# Altium schematic sheet 5DPD8_v1.0_OS_Sheet4.SchDoc: 5DPD8 Controller
size A4; Date: 10th Mar 14; CheckedBy: J. Wong/C. Lai; CompanyName: Makible Ltd.; DrawnBy: Martyn Kay; Engineer: Martyn Kay; Revision: 1.0; SheetNumber: 4; SheetTotal: 4; Website: 5DPrint.com; DesignFileLink: D8 Design Files; BasedOn: Printrboard Rev. B; OSHWLicense: CC BY-SA 4.0
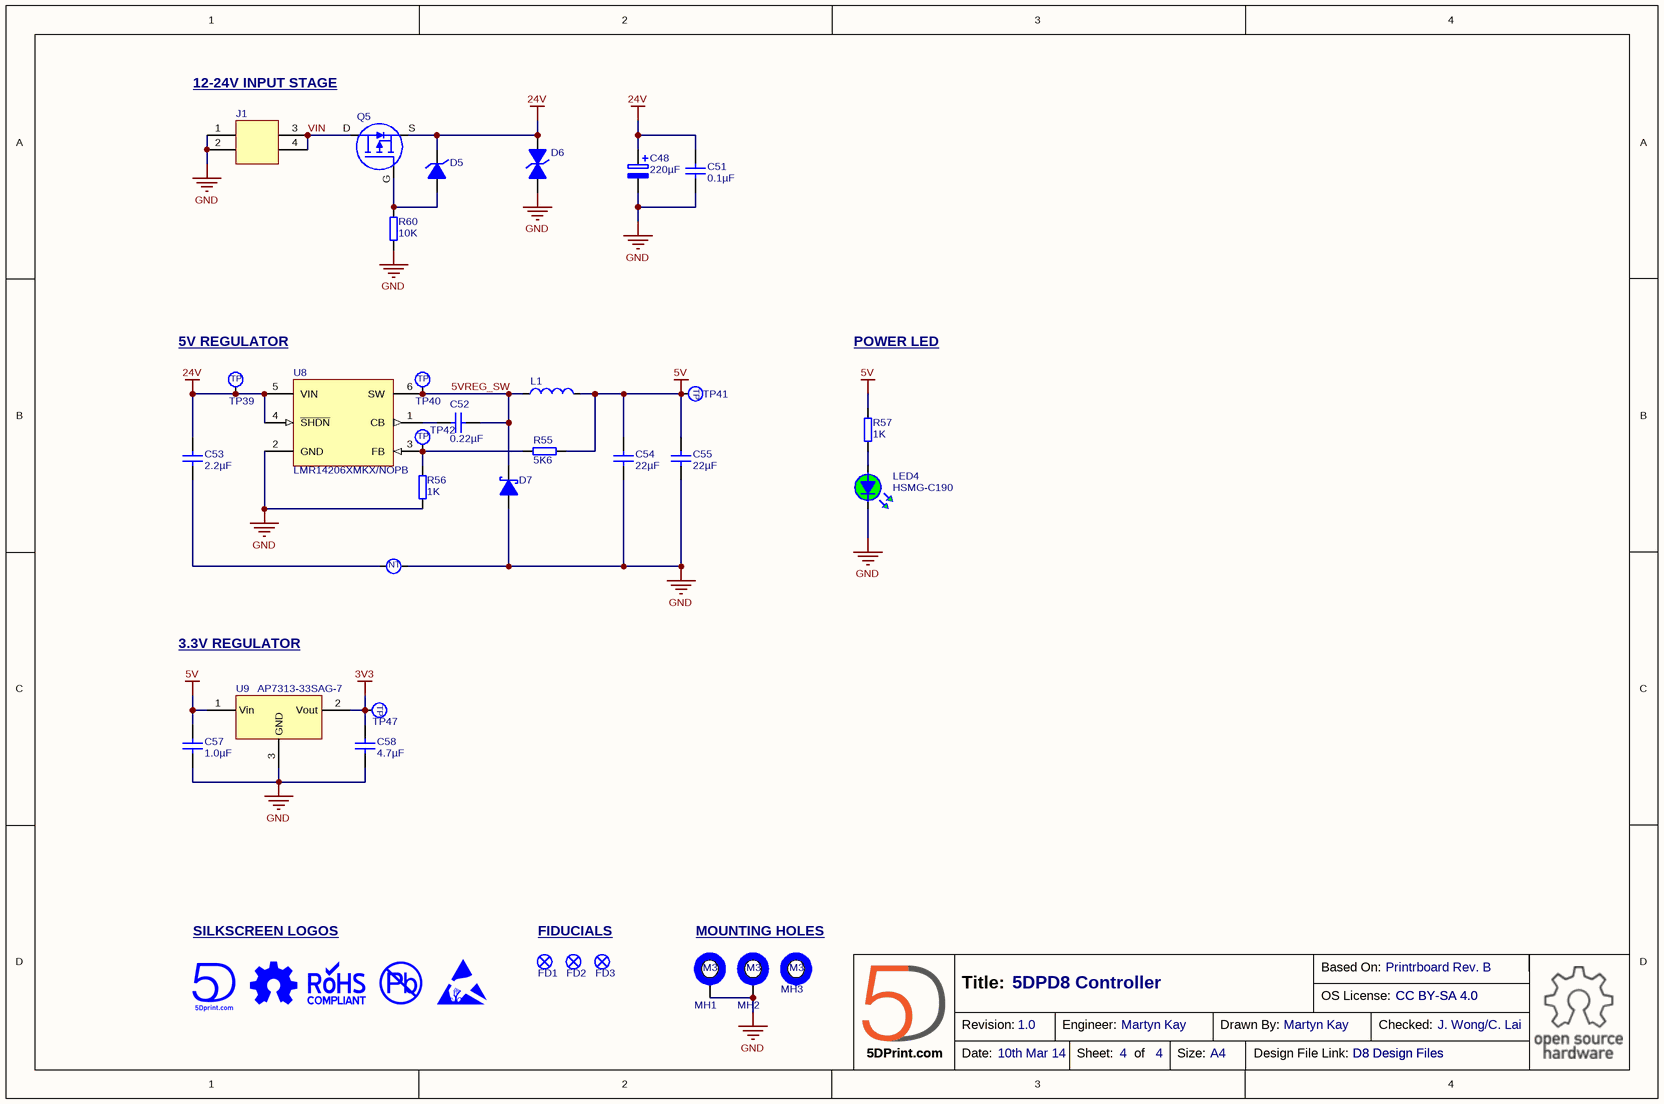
[diagram p0: 5DPD8_v1.0_OS_Sheet4.SchDoc]

## Parts
C48  220µF  [CAPRAD8X11.5]
C51  0.1µF  [CAPC0603(1608)100_N]
C52  0.22µF  [CAPC0603(1608)100_N]
C53  2.2µF  [CAPC0805(2012)145_N]
C54  22µF  [CAPC0805(2012)145_N]
C55  22µF  [CAPC0805(2012)145_N]
C57  1.0µF  [CAPC0603(1608)100_N]
C58  4.7µF  [CAPC0603(1608)100_N]
D5  BZV55-C10,115  [DIOMELF3515N]  (value not drawn)
D6  SMAJ24CA  [DIOM4326X23N-BI]  (value not drawn)
D7  B140-13-F  [DIOM4326X23N-UNI]  (value not drawn)
FD1  MECH_FIDUCIAL  [FIDUCIAL-1MM]  (value not drawn)  (no BOM)
FD2  MECH_FIDUCIAL  [FIDUCIAL-1MM]  (value not drawn)  (no BOM)
FD3  MECH_FIDUCIAL  [FIDUCIAL-1MM]  (value not drawn)  (no BOM)
J1  0039281043  [MOLEX_39-28-1043]  (value not drawn)
L1  SRN6045-220M  [INDP6060X45N]  (value not drawn)
LED4  HSMG-C190  [LEDC0603(1608)_N-GRN]
LG1  5DPRINT  [5DPRINT-10MM]  (value not drawn)  (no BOM)
LG2  ESD  [ESD-5MM]  (value not drawn)  (no BOM)
LG3  LEADFREE  [LEADFREE-5MM]  (value not drawn)  (no BOM)
LG4  OSHW_COG  [OSHW_COG-5MM]  (value not drawn)  (no BOM)
LG6  RoHS  [RoHS-5MM]  (value not drawn)  (no BOM)
MH1  MECH_MH-M3  [M3 MOUNT-3.4MM]  (value not drawn)  (no BOM)
MH2  MECH_MH-M3  [M3 MOUNT-3.4MM]  (value not drawn)  (no BOM)
MH3  MECH_MH-M3-NP  [M3 MOUNT-3.4MM-NOPAD]  (value not drawn)  (no BOM)
NT1  NET_TIE  [NET_TIE-2NET_12MM]  (value not drawn)  (net tie, no BOM)
Q5  SIS427EDN-T1-GE3  [POWERPAK1212-8S]  (value not drawn)
R55  5K6  [RESC0603(1608)_N]
R56  1K  [RESC0603(1608)_N]
R57  1K  [RESC0603(1608)_N]
R60  10K  [RESC0603(1608)_N]
TP39  TESTPOINT  [TESTPOINT]  (value not drawn)  (no BOM)
TP40  TESTPOINT  [TESTPOINT]  (value not drawn)  (no BOM)
TP41  TESTPOINT  [TESTPOINT]  (value not drawn)  (no BOM)
TP42  TESTPOINT  [TESTPOINT]  (value not drawn)  (no BOM)
TP47  TESTPOINT  [TESTPOINT]  (value not drawn)  (no BOM)
U8  LMR14206XMKX/NOPB  [MK06A_N]
U9  AP7313-33SAG-7  [SOT95P237X112-3N]

## Nets
3V3: C58.2 TP47.1 U9.2(Vout)
5V: C54.2 C55.2 C57.2 L1.2 R55.2 R57.2 TP41.1 U9.1(Vin)
24V: C48.1(+) C51.2 C53.2 D5.K D6.1 Q5.S TP39.1 U8.4(~{SHDN}) U8.5(VIN)
GND: C48.2(-) C51.1 C54.1 C55.1 C57.1 C58.1 D6.2 D7.A J1.1 J1.2 LED4.K MH1.MH MH2.MH NT1.2 R56.1 R60.1 U8.2(GND) U9.3(GND)
5VREG_SW: C52.2 D7.K L1.1 TP40.1 U8.6(SW)
VIN: J1.3 J1.4 Q5.D
NetC52_1: C52.1 U8.1(CB)
NetC53_1: C53.1 NT1.1
NetD5_A: D5.A Q5.G R60.2
NetLED4_A: LED4.A R57.1
NetR55_1: R55.1 R56.2 TP42.1 U8.3(FB)

## Notes on the sheet
- 12-24V INPUT STAGE
- 5V REGULATOR
- POWER LED
- 3.3V REGULATOR
- SILKSCREEN LOGOS
- FIDUCIALS
- MOUNTING HOLES
- Based On:
- Title:
- Revision:
- Engineer:
- Drawn By:
- OS License:
- Checked:
- Date:
- Sheet:
- of
- Size:
- A4
- Design File Link:
- (in symbol MECH_MH-M3) M3
- (in symbol MECH_MH-M3-NP) M3
- (in symbol NET_TIE) NT
- (in symbol TESTPOINT) TP

## Library data of the parts
C48 = CAP_RAD-ALU-220UF-35V-20%: CAP ALUM 220UF 35V 20% RADIAL; Manufacturer: Rubycon; ManufacturerPartNumber: 35ZLH220MEFC8X11.5; Lifetime @ Temp.: 8000 Hrs @ 105°C; Ripple Current: 945mA; Impedance: 56 mOhm; Supplier 1: Digi-Key; RoHS: RoHS Compliant; Category: Capacitors; Stock 1: 40821; Pricing 1: 1=0.41, 10=0.288, 25=0.2456, 50=0.2176, 100=0.1895, 250=0.16148, 500=0.1404, 1000=0.11934, 2500=0.11232 (USD); Packaging: Bulk; Capacitance: 220µF; Voltage Rating: 35V; Tolerance: ±20%; ESR (Equivalent Series Resistance): -; Operating Temperature: -40°C ~ 105°C; Type: -; Applications: General Purpose; Lead Spacing: 0.138" (3.50mm); Size / Dimension: 0.315" Dia (8.00mm); Height - Seated (Max): 0.512" (13.00mm); Surface Mount Land Size: -; Mounting Type: Through Hole; Package / Case: Radial, Can; ComponentLink1URL: http://www.rubycon.co.jp/EN/CATALOG/E_PDFS/ALUMINUM/E_ZLH.PDF; ComponentLink1Description: http://www.rubycon.co.jp/EN/CATALOG/E_PDFS/ALUMINUM/E_ZLH.PDF; Supplier Part Number 1: 1189-1863-ND
C51 = C0603-0.1UF-50V-10%-X7R: CAP CER 0.1UF 50V 10% X7R 0603; Manufacturer: Yageo; ManufacturerPartNumber: CC0603KRX7R9BB104; Supplier 1: Digi-Key; RoHS: RoHS Compliant; Category: Capacitors; Stock 1: 2096000; Pricing 1: 4000=0.00513, 8000=0.00468, 12000=0.00446, 28000=0.00424, 100000=0.00307 (USD); Packaging: Tape & Reel (TR); Capacitance: 0.1µF; Voltage - Rated: 50V; Tolerance: ±10%; Temperature Coefficient: X7R; Mounting Type: Surface Mount, MLCC; Operating Temperature: -55°C ~ 125°C; Applications: General Purpose; Ratings: -; Package / Case: 0603 (1608 Metric); Size / Dimension: 0.063" L x 0.031" W (1.60mm x 0.80mm); Height - Seated (Max): -; Thickness (Max): 0.035" (0.90mm); Lead Spacing: -; Features: -; Lead Style: -; ComponentLink1URL: http://www.yageo.com/documents/recent/UPY-GPHC_X7R_6.3V-to-50V_8.pdf; ComponentLink1Description: http://www.yageo.com/documents/recent/UPY-GPHC_X7R_6.3V-to-50V_8.pdf; Supplier Part Number 1: 311-1344-2-ND
C52 = C0603-0.22UF-50V-10%-X7R: CAP CER 0.22UF 50V 10% X7R 0603; Manufacturer: TDK Corporation; ManufacturerPartNumber: C1608X7R1H224K080AB; Supplier 1: Digi-Key; RoHS: RoHS Compliant; Category: Capacitors; Stock 1: 116000; Pricing 1: 4000=0.03, 8000=0.0285, 12000=0.027, 28000=0.0255, 100000=0.02025 (USD); Packaging: Tape & Reel (TR); Capacitance: 0.22µF; Voltage - Rated: 50V; Tolerance: ±10%; Temperature Coefficient: X7R; Mounting Type: Surface Mount, MLCC; Operating Temperature: -55°C ~ 125°C; Applications: General Purpose; Ratings: -; Package / Case: 0603 (1608 Metric); Size / Dimension: 0.063" L x 0.031" W (1.60mm x 0.80mm); Height - Seated (Max): -; Thickness (Max): 0.035" (0.90mm); Lead Spacing: -; Features: -; Lead Style: -; ComponentLink1URL: http://product.tdk.com/capacitor/mlcc/en/documents/mlcc_commercial_general_en.pdf; ComponentLink1Description: http://product.tdk.com/capacitor/mlcc/en/documents/mlcc_commercial_general_en.pdf; Supplier Part Number 1: 445-7408-2-ND
C53 = C0805-2.2UF-50V-10%-X7R: CAP CER 2.2UF 50V 10% X7R 0805; Manufacturer: Taiyo Yuden; ManufacturerPartNumber: UMK212BB7225KG-T; Supplier 1: Digi-Key; RoHS: RoHS Compliant; Category: Capacitors; Stock 1: 0; Pricing 1: 3000=0.05, 6000=0.04625, 9000=0.04375, 15000=0.0415, 30000=0.04, 75000=0.0375, 150000=0.03313 (USD); Packaging: Tape & Reel (TR); Capacitance: 2.2µF; Voltage - Rated: 50V; Tolerance: ±10%; Temperature Coefficient: X7R; Mounting Type: Surface Mount, MLCC; Operating Temperature: -55°C ~ 125°C; Applications: General Purpose; Ratings: -; Package / Case: 0805 (2012 Metric); Size / Dimension: 0.079" L x 0.049" W (2.00mm x 1.25mm); Height - Seated (Max): -; Thickness (Max): 0.057" (1.45mm); Lead Spacing: -; Features: -; Lead Style: -; Supplier Part Number 1: 587-3169-2-ND
C54 C55 = C0805-22UF-10V-10%-X5R: CAP CER 22UF 10V 10% X5R 0805; Manufacturer: TDK Corporation; ManufacturerPartNumber: C2012X5R1A226K125AB; Supplier 1: Digi-Key; RoHS: RoHS Compliant; Category: Capacitors; Stock 1: 22000; Pricing 1: 2000=0.16, 4000=0.15, 10000=0.14, 14000=0.1375, 50000=0.13, 100000=0.125 (USD); Packaging: Tape & Reel (TR); Capacitance: 22µF; Voltage - Rated: 10V; Tolerance: ±10%; Temperature Coefficient: X5R; Mounting Type: Surface Mount, MLCC; Operating Temperature: -55°C ~ 85°C; Applications: General Purpose; Ratings: -; Package / Case: 0805 (2012 Metric); Size / Dimension: 0.079" L x 0.049" W (2.00mm x 1.25mm); Height - Seated (Max): -; Thickness (Max): 0.057" (1.45mm); Lead Spacing: -; Features: -; Lead Style: -; ComponentLink1URL: http://product.tdk.com/capacitor/mlcc/en/documents/mlcc_commercial_general_en.pdf; ComponentLink1Description: http://product.tdk.com/capacitor/mlcc/en/documents/mlcc_commercial_general_en.pdf; Supplier Part Number 1: 445-7664-2-ND
C57 = C0603-1UF-10V-10%-X7R: CAP CER 1UF 10V 10% X7R 0603; Manufacturer: Taiyo Yuden; ManufacturerPartNumber: LMK107B7105KA-T; Supplier 1: Digi-Key; RoHS: RoHS Compliant; Category: Capacitors; Stock 1: 116000; Pricing 1: 4000=0.00782, 8000=0.00714, 12000=0.0068, 28000=0.00646 (USD); Packaging: Tape & Reel (TR); Capacitance: 1.0µF; Voltage - Rated: 10V; Tolerance: ±10%; Temperature Coefficient: X7R; Mounting Type: Surface Mount, MLCC; Operating Temperature: -55°C ~ 125°C; Applications: General Purpose; Ratings: -; Package / Case: 0603 (1608 Metric); Size / Dimension: 0.063" L x 0.031" W (1.60mm x 0.80mm); Height - Seated (Max): -; Thickness (Max): 0.035" (0.90mm); Lead Spacing: -; Features: -; Lead Style: -; ComponentLink1URL: http://www.yuden.co.jp/or/product/category/capacitor/LMK107B7105KA-T.pdf; ComponentLink1Description: http://www.yuden.co.jp/or/product/category/capacitor/LMK107B7105KA-T.pdf; Supplier Part Number 1: 587-1242-2-ND
C58 = C0603-4.7UF-6.3V-10%-X5R: CAP CER 4.7UF 6.3V 10% X5R 0603; Manufacturer: Taiyo Yuden; ManufacturerPartNumber: JMK107BJ475KA-T; Supplier 1: Digi-Key; RoHS: RoHS Compliant; Category: Capacitors; Stock 1: 1856000; Pricing 1: 4000=0.01935, 8000=0.018, 12000=0.0171, 28000=0.0162 (USD); Packaging: Tape & Reel (TR); Capacitance: 4.7µF; Voltage - Rated: 6.3V; Tolerance: ±10%; Temperature Coefficient: X5R; Mounting Type: Surface Mount, MLCC; Operating Temperature: -55°C ~ 85°C; Applications: General Purpose; Ratings: -; Package / Case: 0603 (1608 Metric); Size / Dimension: 0.063" L x 0.031" W (1.60mm x 0.80mm); Height - Seated (Max): -; Thickness (Max): 0.035" (0.90mm); Lead Spacing: -; Features: -; Lead Style: -; ComponentLink1URL: http://www.yuden.co.jp/or/product/category/capacitor/JMK107BJ475KA-T.pdf; ComponentLink1Description: http://www.yuden.co.jp/or/product/category/capacitor/JMK107BJ475KA-T.pdf; Supplier Part Number 1: 587-1785-2-ND
D5 = DIO_BZV55-C10,115: DIODE ZENER 10V 500MW LLDS; Manufacturer: NXP Semiconductors; Tolerance: ±5%; Current - Reverse Leakage @ Vr: 200nA @ 7V; Impedance (Max) (Zzt): 20 Ohm; Voltage - Forward (Vf) (Max) @ If: 900mV @ 10mA; Supplier 1: Digi-Key; ManufacturerPartNumber: BZV55-C10,115; RoHS: RoHS Compliant; Category: Discrete Semiconductor Products; Stock 1: 14344; Pricing 1: 1=0.2, 10=0.184, 25=0.1676, 100=0.1205, 250=0.071, 500=0.0589, 1000=0.04017 (USD); Packaging: Cut Tape (CT); Voltage - Zener (Nom) (Vz): 10V; Power - Max: 500mW; Operating Temperature: -65°C ~ 200°C; Mounting Type: Surface Mount; Package / Case: SOD-80C; Supplier Device Package: LLDS; MiniMelf; ComponentLink1URL: http://www.nxp.com/documents/data_sheet/BZV55_SER.pdf; ComponentLink1Description: http://www.nxp.com/documents/data_sheet/BZV55_SER.pdf; Supplier Part Number 1: 568-6253-1-ND
D6 = DIO_SMAJ24CA: DIODE TVS 24V 400W BIDIR 5% SMA; Manufacturer: Littelfuse Inc; Voltage - Breakdown: 26.7V; Polarization: Bidirectional; Supplier 1: Digi-Key; ManufacturerPartNumber: SMAJ24CA; RoHS: RoHS Compliant; Category: Circuit Protection; Stock 1: 20000; Pricing 1: 5000=0.12572, 10000=0.11705, 25000=0.11098 (USD); Packaging: Tape & Reel (TR); Voltage - Reverse Standoff (Typ): 24V; Power (Watts): 400W; Mounting Type: Surface Mount; Package / Case: DO-214AC, SMA; Supplier Device Package: SMA; ComponentLink1URL: http://www.littelfuse.com/~/media/Electronics_Technical/Datasheets/TVS_Diodes/Littelfuse_TVS_Diode_SMAJ_Datasheet.pdf; ComponentLink1Description: http://www.littelfuse.com/~/media/Electronics_Technical/Datasheets/TVS_Diodes/Littelfuse_TVS_Diode_SMAJ_Datasheet.pdf; Supplier Part Number 1: SMAJ24CALFTR-ND
D7 = DIO_B140-13-F: DIODE SCHOTTKY 40V 1A SMA; Manufacturer: Diodes Inc; Voltage - Forward (Vf) (Max) @ If: 500mV @ 1A; Speed: Fast Recovery =< 500ns, > 200mA (Io); Current - Reverse Leakage @ Vr: 500µA @ 40V; Capacitance @ Vr, F: 110pF @ 4V, 1MHz; Thermal Resistance: 20°C/W Jl; Supplier 1: Digi-Key; ManufacturerPartNumber: B140-13-F; RoHS: RoHS Compliant; Category: Discrete Semiconductor Products; Stock 1: 130000; Pricing 1: 5000=0.063, 10000=0.056, 25000=0.0525, 50000=0.04655, 125000=0.04375 (USD); Packaging: Tape & Reel (TR); Diode Type: Schottky; Voltage - DC Reverse (Vr) (Max): 40V; Current - Average Rectified (Io): 1A; Reverse Recovery Time (trr): -; Mounting Type: Surface Mount; Package / Case: DO-214AC, SMA; Supplier Device Package: SMA; Operating Temperature - Junction: -65°C ~ 150°C; ComponentLink1URL: http://www.diodes.com/datasheets/ds13002.pdf; ComponentLink1Description: http://www.diodes.com/datasheets/ds13002.pdf; Supplier Part Number 1: B140-FDITR-ND
FD1-FD3 = MECH_FIDUCIAL: Fiducial Marker
J1 = CON_MLX_39-28-1043: CONN HEADER 4POS 4.2MM VERT TIN; Manufacturer: Molex Inc; Connector Type: Header, Shrouded; Number of Positions: 4; Number of Positions Loaded: All; Pitch: 0.165" (4.20mm); Supplier 1: Digi-Key; ManufacturerPartNumber: 0039281043; RoHS: RoHS Compliant; Category: Connectors, Interconnects; Stock 1: 10185; Pricing 1: 1=0.73, 10=0.644, 25=0.606, 50=0.5808, 100=0.5555, 250=0.505, 500=0.4545, 1000=0.404, 2500=0.36612 (USD); Packaging: Tray; Contact Type: Male Pin; Number of Rows: 2; Row Spacing: 0.165" (4.20mm); Contact Mating Length: -; Mounting Type: Through Hole; Termination: Solder; Fastening Type: Locking Ramp; Features: -; Contact Finish: Tin; Contact Finish Thickness: 35µin (0.90µm); Color: Natural; ComponentLink1URL: http://www.molex.com/pdm_docs/sd/039281043_sd.pdf; ComponentLink1Description: http://www.molex.com/pdm_docs/sd/039281043_sd.pdf; Supplier Part Number 1: WM3801-ND
L1 = MAG_SRN6045-220M: INDUCTOR POWER SHIELD 22UH SMD; Manufacturer: Bourns Inc.; Type: Wirewound; Material - Core: Ferrite; Inductance: 22µH; Tolerance: ±20%; Current Rating: 1.5A; Current - Saturation: 1.9A; Shielding: Shielded; DC Resistance (DCR): 142 mOhm Max; Frequency - Test: 100kHz; Supplier 1: Digi-Key; ManufacturerPartNumber: SRN6045-220M; RoHS: RoHS Compliant; Category: Inductors, Coils, Chokes; Stock 1: 3000; Pricing 1: 1000=0.204, 2000=0.18, 3000=0.162, 5000=0.1596, 10000=0.156, 25000=0.15, 50000=0.147 (USD); Packaging: Tape & Reel (TR); Q @ Freq: -; Frequency - Self Resonant: -; Operating Temperature: -40°C ~ 125°C; Mounting Type: Surface Mount; Package / Case: Non Standard; Size / Dimension: 0.236" L x 0.236" W (6.00mm x 6.00mm); Height - Seated (Max): 0.177" (4.50mm); Supplier Device Package: -; ComponentLink1URL: http://www.bourns.com/data/global/pdfs/SRN6045.pdf; ComponentLink1Description: http://www.bourns.com/data/global/pdfs/SRN6045.pdf; Supplier Part Number 1: SRN6045-220MTR-ND
LED4 = LED_HSMG-C190: LED 570NM GREEN DIFF 0603 SMD; Manufacturer: Avago Technologies US Inc.; Wavelength - Dominant: 572nm; Millicandela Rating: 15mcd; Voltage - Forward (Vf) Typ: 2.2V; Current - Test: 20mA; Viewing Angle: 170°; Lens Type: Diffused; Lens Style/Size: Rectangle with Flat Top, 1mm x 0.8mm; Supplier 1: Digi-Key; ManufacturerPartNumber: HSMG-C190; RoHS: RoHS Compliant; Category: Optoelectronics; Stock 1: 28000; Pricing 1: 4000=0.08, 8000=0.072, 12000=0.064, 28000=0.06, 100000=0.052 (USD); Packaging: Tape & Reel (TR); Color: Green; Wavelength - Peak: 570nm; Package / Case: 0603 (1608 Metric); Size / Dimension: 1.60mm L x 0.80mm W; Height: 0.80mm; Mounting Type: Surface Mount; Luminous Flux @ Current - Test: -; ComponentLink1URL: http://www.avagotech.com/docs/AV02-0551EN; ComponentLink1Description: http://www.avagotech.com/docs/AV02-0551EN; Supplier Part Number 1: 516-1425-2-ND
LG1 = 5DPRINT: 5D PRINT SILKSCREEN LOGO
LG2 = ESD: ESD WARNING SILKSCREEN LOGO
LG3 = LEADFREE: Pb-FREE SILKSCREEN LOGO
LG4 = OSHW_COG: OSHW COG SILKSCREEN LOGO
LG6 = RoHS: RoHS SILKSCREEN LOGO
MH1 MH2 = MECH_MH-M3: M3 Mounting Hole
MH3 = MECH_MH-M3-NP: M3 Mounting Hole - no pad, unplated
NT1 = NET_TIE: NET TIE
Q5 = FETP_SIS427EDN-T1-GE3: MOSFET P-CHAN 30V 1212-8; Manufacturer: Vishay Siliconix; FET Type: MOSFET P-Channel, Metal Oxide; FET Feature: Standard; Current - Continuous Drain (Id) @ 25° C: 50A (Tc); Rds On (Max) @ Id, Vgs: 10.6 mOhm @ 11A, 10V; Vgs(th) (Max) @ Id: 2.5V @ 250µA; Gate Charge (Qg) @ Vgs: 66nC @ 10V; Input Capacitance (Ciss) @ Vds: 1930pF @ 15V; Power - Max: 52W; Supplier 1: Digi-Key; ManufacturerPartNumber: SIS427EDN-T1-GE3; RoHS: RoHS Compliant; Category: Discrete Semiconductor Products; Stock 1: 0; Pricing 1: 3000=0.261, 6000=0.243, 15000=0.234, 30000=0.225, 75000=0.2214, 150000=0.216 (USD); Packaging: Tape & Reel (TR); Drain to Source Voltage (Vdss): 30V; Mounting Type: Surface Mount; Package / Case: PowerPAK® 1212-8; Supplier Device Package: PowerPAK® 1212-8; ComponentLink1URL: http://www.vishay.com/docs/62856/sis427edn.pdf; ComponentLink1Description: http://www.vishay.com/docs/62856/sis427edn.pdf; Supplier Part Number 1: SIS427EDN-T1-GE3TR-ND
R55 = R0603-5K6-0.1W-1%: RES 5.60K OHM 1/10W 1% 0603 SMD; Manufacturer: Yageo; ManufacturerPartNumber: RC0603FR-075K6L; Power (Watts): 0.1W, 1/10W; Temperature Coefficient: ±100ppm/°C; Supplier 1: Digi-Key; RoHS: RoHS Compliant; Category: Resistors; Stock 1: 140000; Pricing 1: 5000=0.00171, 10000=0.00149, 25000=0.00131, 50000=0.0012, 125000=0.00117 (USD); Packaging: Tape & Reel (TR); Resistance: 5K6; Tolerance: ±1%; Composition: Thick Film; Features: -; Package / Case: 0603 (1608 Metric); Supplier Device Package: 0603; Size / Dimension: 0.063" L x 0.031" W (1.60mm x 0.80mm); Height: 0.022" (0.55mm); Number of Terminations: 2; ComponentLink1URL: http://www.yageo.com/documents/recent/PYu-RC0603_51_RoHS_L_4.pdf; ComponentLink1Description: http://www.yageo.com/documents/recent/PYu-RC0603_51_RoHS_L_4.pdf; Supplier Part Number 1: 311-5.60KHRTR-ND
R56 R57 = R0603-1K-0.1W-1%: RES 1.00K OHM 1/10W 1% 0603 SMD; Manufacturer: Yageo; ManufacturerPartNumber: RC0603FR-071KL; Power (Watts): 0.1W, 1/10W; Temperature Coefficient: ±100ppm/°C; Supplier 1: Digi-Key; RoHS: RoHS Compliant; Category: Resistors; Stock 1: 1620000; Pricing 1: 5000=0.00171, 10000=0.00149, 25000=0.00131, 50000=0.0012, 125000=0.00117 (USD); Packaging: Tape & Reel (TR); Resistance: 1K; Tolerance: ±1%; Composition: Thick Film; Features: -; Package / Case: 0603 (1608 Metric); Supplier Device Package: 0603; Size / Dimension: 0.063" L x 0.031" W (1.60mm x 0.80mm); Height: 0.022" (0.55mm); Number of Terminations: 2; ComponentLink1URL: http://www.yageo.com/documents/recent/PYu-RC0603_51_RoHS_L_4.pdf; ComponentLink1Description: http://www.yageo.com/documents/recent/PYu-RC0603_51_RoHS_L_4.pdf; Supplier Part Number 1: 311-1.00KHRTR-ND
R60 = R0603-10K-0.1W-5%: RES 10K OHM 1/10W 5% 0603 SMD; Manufacturer: Yageo; ManufacturerPartNumber: RC0603JR-0710KL; Power (Watts): 0.1W, 1/10W; Temperature Coefficient: ±100ppm/°C; Supplier 1: Digi-Key; RoHS: RoHS Compliant; Category: Resistors; Stock 1: 0; Pricing 1: 5000=0.00131, 10000=0.00114, 25000=0.001, 50000=0.00092, 125000=0.0009 (USD); Packaging: Tape & Reel (TR); Resistance: 10K; Tolerance: ±5%; Composition: Thick Film; Features: -; Package / Case: 0603 (1608 Metric); Supplier Device Package: 0603; Size / Dimension: 0.063" L x 0.031" W (1.60mm x 0.80mm); Height: 0.022" (0.55mm); Number of Terminations: 2; ComponentLink1URL: http://www.yageo.com/documents/recent/PYu-RC0603_51_RoHS_L_4.pdf; ComponentLink1Description: http://www.yageo.com/documents/recent/PYu-RC0603_51_RoHS_L_4.pdf; Supplier Part Number 1: 311-10KGRTR-ND
U8 = IC_LMR14206XMKX/NOPB: IC REG BUCK ADJ 0.6A 6TSOT; Manufacturer: Texas Instruments; Output Type: Adjustable; Number of Outputs: 1; Voltage - Output: 0.765 V ~ 34 V; Voltage - Input: 4.5 V ~ 42 V; PWM Type: Current Mode; Frequency - Switching: 1.25MHz; Current - Output: 600mA; Synchronous Rectifier: No; Supplier 1: Digi-Key; ManufacturerPartNumber: LMR14206XMKX/NOPB; RoHS: RoHS Compliant; Category: Integrated Circuits (ICs); Stock 1: 0; Pricing 1: 3000=1.11375 (USD); Packaging: Tape & Reel (TR); Type: Step-Down (Buck); Operating Temperature: -40°C ~ 125°C; Mounting Type: Surface Mount; Package / Case: SOT-23-6 Thin, TSOT-23-6; Supplier Device Package: TSOT-23-6; ComponentLink1URL: http://www.ti.com/lit/ds/symlink/lmr14206.pdf; ComponentLink1Description: http://www.ti.com/lit/ds/symlink/lmr14206.pdf; Supplier Part Number 1: LMR14206XMKX/NOPB-ND
U9 = IC_AP7313-33SAG-7: IC REG LDO 3.3V 0.15A SOT23-3; Manufacturer: Diodes Inc; Number of Regulators: 1; Regulator Topology: Positive Fixed; Voltage - Input: Up to 6V; Voltage - Dropout (Typical): 0.15V @ 150mA; Current - Output: 150mA (Max); Current - Limit (Min): 200mA; Supplier 1: Digi-Key; ManufacturerPartNumber: AP7313-33SAG-7; RoHS: RoHS Compliant; Category: Integrated Circuits (ICs); Stock 1: 6000; Pricing 1: 3000=0.1122, 6000=0.1054, 15000=0.0986, 30000=0.09044, 75000=0.08704, 150000=0.08364 (USD); Packaging: Tape & Reel (TR); Voltage - Output: 3.3V; Operating Temperature: -40°C ~ 85°C; Mounting Type: Surface Mount; Package / Case: TO-236-3, SC-59, SOT-23-3; Supplier Device Package: SOT-23-3; ComponentLink1URL: http://www.diodes.com/datasheets/AP7313.pdf; ComponentLink1Description: http://www.diodes.com/datasheets/AP7313.pdf; Supplier Part Number 1: AP7313-33SAG-7DITR-ND